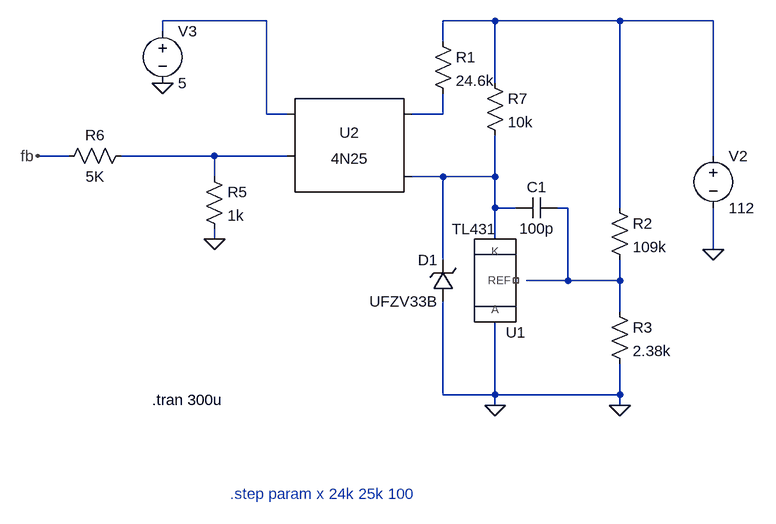
[diagram p0: schematic sch.asc]
sch.asc, the LTspice schematic file:
Version 4
SHEET 1 880 680
WIRE -304 -80 -464 -80
WIRE 48 -80 -32 -80
WIRE 240 -80 48 -80
WIRE 384 -80 240 -80
WIRE -464 -64 -464 -80
WIRE -32 -48 -32 -80
WIRE 48 16 48 -80
WIRE -304 64 -304 -80
WIRE -272 64 -304 64
WIRE -32 64 -32 32
WIRE -32 64 -80 64
WIRE -608 128 -656 128
WIRE -384 128 -528 128
WIRE -272 128 -384 128
WIRE 384 128 384 -80
WIRE -384 160 -384 128
WIRE -32 160 -80 160
WIRE 48 160 48 96
WIRE 48 160 -32 160
WIRE 48 208 48 160
WIRE 80 208 48 208
WIRE 160 208 144 208
WIRE 240 208 240 -80
WIRE -384 256 -384 240
WIRE 48 256 48 208
WIRE 384 272 384 208
WIRE -32 288 -32 160
WIRE 160 320 160 208
WIRE 160 320 96 320
WIRE 240 320 240 288
WIRE 240 320 160 320
WIRE 240 368 240 320
WIRE -32 496 -32 352
WIRE 48 496 48 384
WIRE 48 496 -32 496
WIRE 240 496 240 448
WIRE 240 496 48 496
WIRE 48 512 48 496
WIRE 240 512 240 496
FLAG 240 512 0
FLAG 384 272 0
FLAG 48 512 0
FLAG -384 256 0
FLAG -656 128 fb
FLAG -464 16 0
SYMBOL Optos\\4N25 -176 128 M0
SYMATTR InstName U2
SYMBOL res -48 -64 R0
SYMATTR InstName R1
SYMATTR Value 24.6k
SYMBOL res 224 192 R0
SYMATTR InstName R2
SYMATTR Value 109k
SYMBOL res 224 352 R0
SYMATTR InstName R3
SYMATTR Value 2.38k
SYMBOL zener -16 352 R180
WINDOW 0 24 64 Left 2
WINDOW 3 24 0 Left 2
SYMATTR InstName D1
SYMATTR Value UFZV33B
SYMBOL voltage 384 112 R0
WINDOW 123 0 0 Left 0
WINDOW 39 0 0 Left 0
SYMATTR InstName V2
SYMATTR Value 112
SYMBOL AutoGenerated\\TL431 48 320 R180
SYMATTR InstName U1
SYMBOL res -400 144 R0
SYMATTR InstName R5
SYMATTR Value 1k
SYMBOL voltage -464 -80 R0
WINDOW 123 0 0 Left 0
WINDOW 39 0 0 Left 0
SYMATTR InstName V3
SYMATTR Value 5
SYMBOL res -512 112 R90
WINDOW 0 0 56 VBottom 2
WINDOW 3 32 56 VTop 2
SYMATTR InstName R6
SYMATTR Value 5K
SYMBOL res 32 0 R0
SYMATTR InstName R7
SYMATTR Value 10k
SYMBOL cap 144 192 R90
WINDOW 0 0 32 VBottom 2
WINDOW 3 32 32 VTop 2
SYMATTR InstName C1
SYMATTR Value 100p
TEXT -480 504 Left 2 !.tran 300u
TEXT -360 648 Left 2 ;.step param x 24k 25k 100

The netlist it stands for:
* sch.asc
XU2 N003 N005 N001 N004 NC_01 4N25
R1 N002 N003 24.6k
R2 N002 N006 109k
R3 N006 0 2.38k
D1 0 N005 UFZV33B
V2 N002 0 112
XU1 NC_02 0 N005 TL431  ; pins REF A K
R5 N004 0 1k
V3 N001 0 5
R6 N004 fb 5K
R7 N002 N005 10k
C1 N006 N005 100p
.model D D
.lib standard.dio
.tran 300u
* .step param x 24k 25k 100
.lib 4N25.sub
.lib D:\00 - ITBA\Electrónica 4\TPF\TP-FINAL\Simulation\OTROS\PWM\tl431.mod
.backanno
.end